# Altium schematic sheet MezzanineConnectors_Cortes.SchDoc
size 420 x 297 mm; SheetNumber: 9; SheetTotal: 14; PageSetup: Record=PageOptions|CenterHorizontal=True|CenterVertical=True|PrintScale=0.96|XCorrection=1.00|YCorrection=1.00|PrintKind=1|BorderSize=5000000|LeftOffset=0|BottomOffset=0|Orientation=2|PaperLength=4318|PaperWidth=2794|Scale=100|PaperSource=7|PrintQuality=600|MediaType=1|DitherType=10|PaperKind=11" x 17"|PrintScaleMode=1
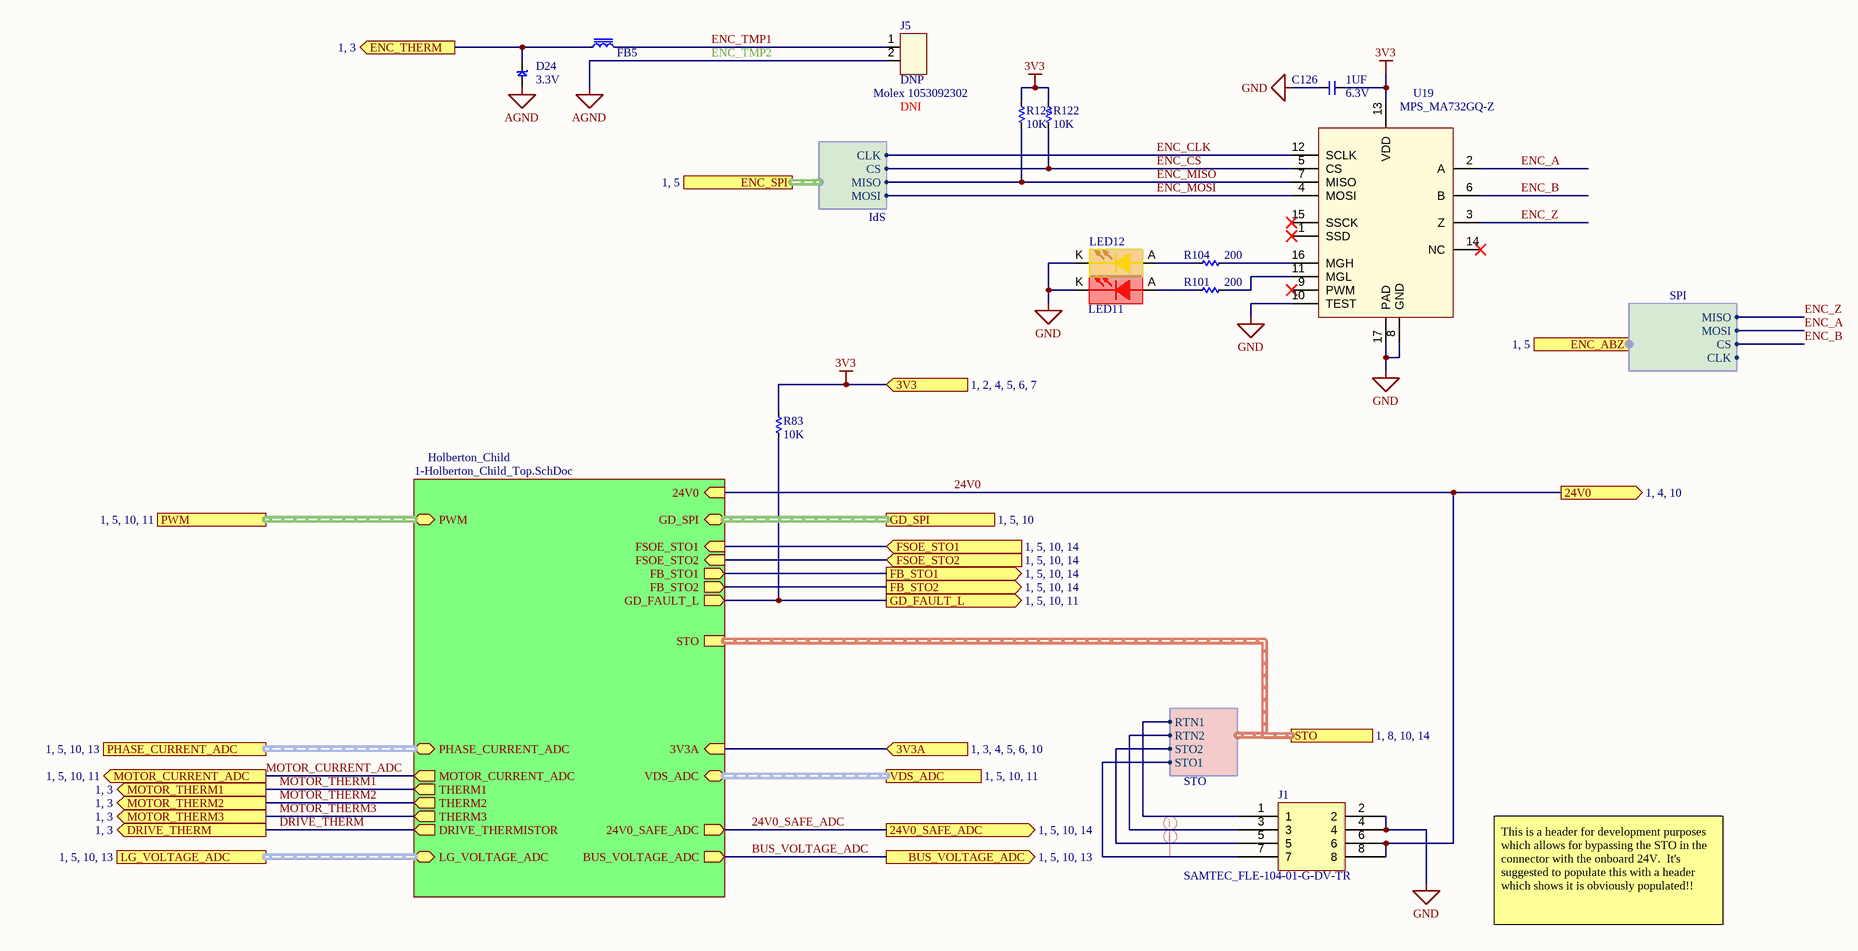
[diagram p0: MezzanineConnectors_Cortes.SchDoc]

## Parts
C126  value 1UF  Voltage: 6.3V  [C0201]  (hidden comment: __Template_Cap)
D24  3.3V  [SOD1060X40]
FB5  LAIRD MI0603L221R-10  [INDC160X80X105L30N]  (value not drawn)
J1  SAMTEC_FLE-104-01-G-DV-TR  [SAMTEC_FLE-104-01-G-DV-TR]
J5  DNP  value Molex 1053092302  [Molex 1053092302]
LED11  APHHS1005SURCK  [LED_APHHS1005SURCK]  (value not drawn)
LED12  SML-P11DTT86R  [LED_SML-P11DTT86R]  (value not drawn)
R83  value 10K  [R0201]  (hidden comment: __Template_Resistor)
R101  200  [R0201]
R104  200  [R0201]
R122  value 10K  [R0201]  (hidden comment: __Template_Resistor)
R123  value 10K  [R0201]  (hidden comment: __Template_Resistor)
U19  MPS_MA732GQ-Z  [MPS_MA732GQ-Z]

## Sub-sheets
Holberton_Child = 1-Holberton_Child_Top.SchDoc: PWM (bidir), GD_SPI (bidir), STO (harness STO), FSOE_STO1 (in), FSOE_STO2 (in), FB_STO1 (out), FB_STO2 (out), GD_FAULT_L (out), PHASE_CURRENT_ADC (bidir), MOTOR_CURRENT_ADC (out), THERM1 (out), THERM2 (out), THERM3 (out), DRIVE_THERMISTOR (out), LG_VOLTAGE_ADC (bidir), VDS_ADC (bidir), 24V0_SAFE_ADC (out), BUS_VOLTAGE_ADC (out), 3V3A (in), 24V0 (in)

## Ports
3V3 (in, see 1, 2, 4, 5, 6, 7), 3V3A (in, see 1, 3, 4, 5, 6, 10), 24V0 (out, see 1, 4, 10), 24V0_SAFE_ADC (out, see 1, 5, 10, 14), BUS_VOLTAGE_ADC (out, see 1, 5, 10, 13), DRIVE_THERM (out, see 1, 3), ENC_ABZ (harness SPI, see 1, 5), ENC_SPI (harness SPI, see 1, 5), ENC_THERM (out, see 1, 3), FB_STO1 (out, see 1, 5, 10, 14), FB_STO2 (out, see 1, 5, 10, 14), FSOE_STO1 (in, see 1, 5, 10, 14), FSOE_STO2 (in, see 1, 5, 10, 14), GD_FAULT_L (out, see 1, 5, 10, 11), GD_SPI (harness SPI, see 1, 5, 10), LG_VOLTAGE_ADC (harness Phases, see 1, 5, 10, 13), MOTOR_CURRENT_ADC (out, see 1, 5, 10, 11), MOTOR_THERM1 (out, see 1, 3), MOTOR_THERM2 (out, see 1, 3), MOTOR_THERM3 (out, see 1, 3), PHASE_CURRENT_ADC (harness Phases, see 1, 5, 10, 13), PWM (harness PWM, see 1, 5, 10, 11), STO (harness STO, see 1, 8, 10, 14), VDS_ADC (harness Phases, see 1, 5, 10, 11)

## Harnesses
SPI: CLK, CS, MOSI, MISO
STO: RTN1, RTN2, STO1, STO2

## Nets
3V3: C126.2 R83.2 R122.2 R123.2 U19.13(VDD) ; port 3V3
AGND: D24.A J5.2
GND: C126.1 J1.2 J1.4 LED11.K LED12.K U19.8(GND) U19.10(TEST) U19.17(PAD)
3V3A: port 3V3A, sheet Holberton_Child/3V3A
24V0: J1.6 J1.8 ; port 24V0, sheet Holberton_Child/24V0
24V0_SAFE_ADC: port 24V0_SAFE_ADC, sheet Holberton_Child/24V0_SAFE_ADC
BUS_VOLTAGE_ADC: port BUS_VOLTAGE_ADC, sheet Holberton_Child/BUS_VOLTAGE_ADC
DRIVE_THERM: port DRIVE_THERM, sheet Holberton_Child/DRIVE_THERMISTOR
ENC_A: U19.2(A) ; port ENC_ABZ.MOSI
ENC_B: U19.6(B) ; port ENC_ABZ.CS
ENC_CLK: U19.12(SCLK) ; port ENC_SPI.CLK
ENC_CS: R122.1 U19.5(CS) ; port ENC_SPI.CS
ENC_MISO: R123.1 U19.7(MISO) ; port ENC_SPI.MISO
ENC_MOSI: U19.4(MOSI) ; port ENC_SPI.MOSI
ENC_THERM: D24.K FB5.1 ; port ENC_THERM
ENC_TMP1: FB5.2 J5.1
ENC_Z: U19.3(Z) ; port ENC_ABZ.MISO
FB_STO1: port FB_STO1, sheet Holberton_Child/FB_STO1
FB_STO2: port FB_STO2, sheet Holberton_Child/FB_STO2
FSOE_STO1: port FSOE_STO1, sheet Holberton_Child/FSOE_STO1
FSOE_STO2: port FSOE_STO2, sheet Holberton_Child/FSOE_STO2
GD_FAULT_L: R83.1 ; port GD_FAULT_L, sheet Holberton_Child/GD_FAULT_L
MOTOR_CURRENT_ADC: port MOTOR_CURRENT_ADC, sheet Holberton_Child/MOTOR_CURRENT_ADC
MOTOR_THERM1: port MOTOR_THERM1, sheet Holberton_Child/THERM1
MOTOR_THERM2: port MOTOR_THERM2, sheet Holberton_Child/THERM2
MOTOR_THERM3: port MOTOR_THERM3, sheet Holberton_Child/THERM3
NetJ1_1: J1.1 ; port STO.RTN1
NetJ1_3: J1.3 ; port STO.RTN2
NetJ1_5: J1.5 ; port STO.STO2
NetJ1_7: J1.7 ; port STO.STO1
NetLED11_A: LED11.A R101.2
NetLED12_A: LED12.A R104.2
NetR101_1: R101.1 U19.11(MGL)
NetR104_1: R104.1 U19.16(MGH)

Not connected (* = marked no-connect by the designer): U19 1(SSD)* 9(PWM)* 14(NC)* 15(SSCK)*

## Buses and harness runs
harness port GD_SPI = sheet Holberton_Child/GD_SPI
harness port LG_VOLTAGE_ADC = sheet Holberton_Child/LG_VOLTAGE_ADC
harness port PHASE_CURRENT_ADC = sheet Holberton_Child/PHASE_CURRENT_ADC
harness port PWM = sheet Holberton_Child/PWM
harness port STO = sheet Holberton_Child/STO
harness port VDS_ADC = sheet Holberton_Child/VDS_ADC

## Layout directives
net class 24V: NetJ1_5, NetJ1_7

## Notes on the sheet
- ENC_TMP2
- This is a header for development purposes which allows for bypassing the STO in the connector with the onboard 24V.  It's suggested to populate this with a header which shows it is obviously populated!!
- CREATIVE COMMONS
- PUBLIC LICENSE:
- BARKOUR ROBOT
- CC BY-NC 4.0
- APPROVED
- DWG NO
- GOOGLE LLC
- FILE
- RELEASED
- 2024/05/09
- SIZE
- 1600 AMPHITHEATRE PARKWAY
- MOUNTAIN VIEW CA 94043
- A3
- SHEET
- OF
- THIS DESIGN IS BEING PROVIDED  FOR NON-COMMERCIAL USE ONLY. THE USE OF =SCIENTIST_NAME_POSSESSIVE NAME IN CONNECTION WITH THE DESIGN IS NOT INTENDED TO IMPLY THAT =SCIENTIST_NAME SPONSORS OR ENDORSES THE DESIGN, GOOGLE LLC, OR ANY OF GOOGLE LLC'S PRODUCTS OR SERVICES.

## Library data of the parts
C126 = 240: CAP, CER, X5R, 1uF, 6.3V, 20%, 0201, 0.33mm T; MFG: SAMSUNG; MFG P/N: CL03A105MQ3CSNC; COMMON: 150-00980-00; Status: Released; Package: 0201; Supplier 1: Digi-Key; ComponentLink1URL: https://www.digikey.com/en/products/detail/samsung-electro-mechanics/CL03A105MQ3CSNC/3886983; Supplier Part Number 1: 1276-1325-1-ND
D24 = 192: TVS, DIODE, UNIDIR, 3.3VRWM, 4.8VBR, 7.8VCL, SOD-923; MFG: ON Semiconductor; MFG P/N: ESD9R3.3ST5G; Value: ESD9R3.3ST5G; Status: Released; Package: SOD-923; Supplier 1: Digi-Key; ComponentLink1URL: http://www.onsemi.com/pub/Collateral/ESD9R3.3S-D.PDF; Supplier Part Number 1: ESD9R3.3ST5GOSCT-ND
FB5 = LAIRD_MI0603L221R-10: FERRITE BEAD 220 OHM 0603 1LN; Value: 220 Ohms @ 100 MHz; MFG: Laird-Signal Integrity Products; Package: Inductor, 0603; ComponentLink1URL: https://media.digikey.com/pdf/Data%20Sheets/Laird%20Technologies/EMI_Filtering_and_RF_Inductors.pdf; Status: Preliminary; Supplier 1: Digi-Key; Supplier Part Number 1: 240-2558-1-ND; MFG P/N: MI0603L221R-10
J1 = SAMTEC_FLE-104-01-G-DV-TR: CONN RCPT .05" 8POS DUAL SMD; MFG: Samtec Inc.; Supplier 1: Digi-Key; Supplier Part Number 1: SAM1226-04-ND; ComponentLink1URL: https://datasheet.ciiva.com/747/fle-1xx-xx-xx-dv-x-mkt1-747009.pdf?src-supplier=Digi-Key; MFG P/N: FLE-104-01-G-DV; Value: FLE-104-01-G-DV
J5 = Molex 1053092302: CONN HEADER VERT 2POS 2.5MM; MFG: Molex; ComponentLink1URL: https://www.digikey.com/en/products/detail/molex/1053092302/6164139; MFG P/N: 1053092302; Supplier 1: Digi-Key; Supplier Part Number 1: WM15050-ND; DNI: DNI
LED11 = APHHS1005SURCK: LED RED CLEAR CHIP SMD; MFG: Kingbright; Status: Released; MFG P/N: APHHS1005SURCK; Package: 0402; Value: APHHS1005SURCK; Supplier 1: Digi-Key; ComponentLink1URL: http://www.kingbrightusa.com/images/catalog/SPEC/APG0603SYC-TT.pdf; Supplier Part Number 1: 754-1104-1-ND
LED12 = SML-P11DTT86R: LED ORANGE CLEAR 1006 SMD; MFG: Rohm Semiconductor; Status: Released; MFG P/N: SML-P11DTT86R; Package: 0402; Value: SML-P11DTT86R; Supplier 1: Digi-Key; ComponentLink1URL: http://www.kingbrightusa.com/images/catalog/SPEC/APG0603SYC-TT.pdf; Supplier Part Number 1: SML-P11DTT86RCT-ND
R83 R122 R123 = 6783: RES, 10K, 1%, 1/20W, 0201, AUTOGRADE; MFG: PANASONIC; MFG P/N: ERJ1GNF1002C; COMMON: 470-00033-00; Status: Released; Package: 0201; Supplier 1: Digi-Key; ComponentLink1URL: https://industrial.panasonic.com/cdbs/www-data/pdf/RDA0000/AOA0000C304.pdf; Supplier Part Number 1: P122414CT-ND
R101 R104 = 10010: RES, 200, 1%, 1/20W, 0201, AUTOGRADE; MFG: Panasonic Electronic Components; MFG P/N: ERJ-1GNF2000C; Status: Released; Package: 0201; Value: 200; Supplier 1: Digi-Key; ComponentLink1URL: https://www.bourns.com/docs/product-datasheets/crxxxxa.pdf; Supplier Part Number 1: P122416CT-ND
U19 = MPS_MA732GQ-Z: 14-BIT, DIGITAL, CONTACTLESS ANG; MFG: Monolithic Power Systems Inc.; ComponentLink1URL: https://www.digikey.com/en/products/detail/monolithic-power-systems-inc/MA732GQ-Z/15196210; MFG P/N: MA732GQ-Z; Supplier 1: Digi-Key; Supplier Part Number 1: 1589-MA732GQ-ZCT-ND; Value: MA732GQ-Z